# Altium schematic sheet HBridge.SchDoc
size 420 x 297 mm; DocumentNumber: 3; SheetNumber: 3; SheetTotal: 6; PageSetup: Record=PageOptions|CenterHorizontal=True|CenterVertical=True|PrintScale=0.96|XCorrection=1.00|YCorrection=1.00|PrintKind=1|BorderSize=5000000|LeftOffset=0|BottomOffset=0|Orientation=2|PaperLength=4318|PaperWidth=2794|Scale=100|PaperSource=7|PrintQuality=600|MediaType=1|DitherType=10|PaperKind=11" x 17"|PrintScaleMode=1
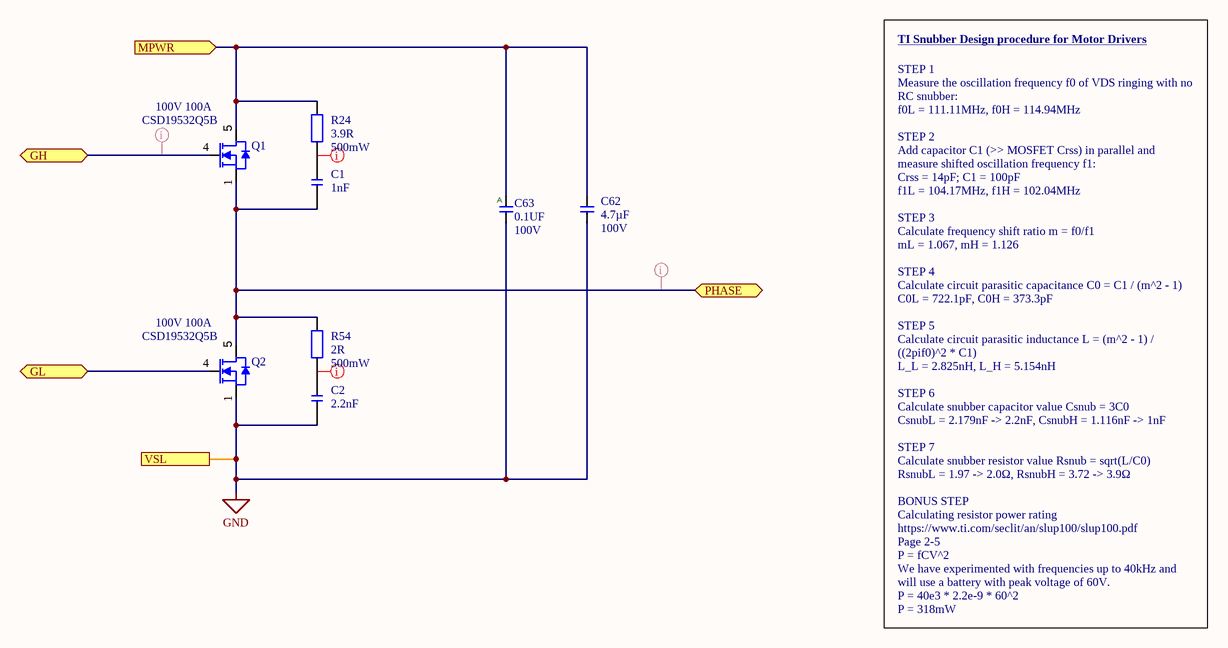
[diagram p0: HBridge.SchDoc]

## Parts
C1  1nF  [CAP 0603_1608 RF]
C2  2.2nF  [CAP 0603_1608 RF]
C62  Voltage - Rated: 100V  Capacitance: 4.7µF  [C1210]  (hidden comment: CAP_CER_1210_4.7UF_100V_20%_X7S)
C63  value 0.1UF  Voltage: 100V  [C0603]  (hidden comment: __Template_Cap_Auto)
NT1  Mechanical Feature NET_TIE_10MIL  [NETTIE_10MIL]  (value not drawn)  (net tie, no BOM)
Q1  value 100V 100A  Manufacturer Part Number: CSD19532Q5B  [TI_SON5X6]  (hidden comment: TI CSD19532Q5B)
Q2  value 100V 100A  Manufacturer Part Number: CSD19532Q5B  [TI_SON5X6]  (hidden comment: TI CSD19532Q5B)
R24  3.9R  Power Rating: 500mW  [RES 0805_2012 RF]
R54  2R  Power Rating: 500mW  [RES 0805_2012 RF]

## Ports
GH (bidir), GL (bidir), MPWR (in), PHASE (bidir), VSL (out)

## Nets
GND: C2.1 C62.2 C63.2 NT1.2 Q2.1(S)
GH: Q1.4(G) ; port GH
GL: Q2.4(G) ; port GL
MPWR: C62.1 C63.1 Q1.5(D) R24.2 ; port MPWR
PHASE: C1.1 Q1.1(S) Q2.5(D) R54.2 ; port PHASE
VSL: NT1.1 ; port VSL
NetC1_2: C1.2 R24.1
NetC2_2: C2.2 R54.1

## Layout directives
net class HVSW: GH, PHASE
net class HV: NetC1_2, NetC2_2

## Notes on the sheet
- TI Snubber Design procedure for Motor Drivers <https://e2e.ti.com/support/motor-drivers-group/motor-drivers/f/motor-drivers-forum/991693/faq-proper-rc-snubber-design-for-motor-drivers>
- STEP 1
  Measure the oscillation frequency f0 of VDS ringing with no RC snubber:
  f0L = 111.11MHz, f0H = 114.94MHz
  STEP 2
  Add capacitor C1 (>> MOSFET Crss) in parallel and measure shifted oscillation frequency f1:
  Crss = 14pF; C1 = 100pF
  f1L = 104.17MHz, f1H = 102.04MHz
  STEP 3
  Calculate frequency shift ratio m = f0/f1
  mL = 1.067, mH = 1.126
  STEP 4
  Calculate circuit parasitic capacitance C0 = C1 / (m^2 - 1)
  C0L = 722.1pF, C0H = 373.3pF
  STEP 5
  Calculate circuit parasitic inductance L = (m^2 - 1) / ((2pif0)^2 * C1)
  L_L = 2.825nH, L_H = 5.154nH
  STEP 6
  Calculate snubber capacitor value Csnub = 3C0
  CsnubL = 2.179nF -> 2.2nF, CsnubH = 1.116nF -> 1nF
  STEP 7
  Calculate snubber resistor value Rsnub = sqrt(L/C0)
  RsnubL = 1.97 -> 2.0Ω, RsnubH = 3.72 -> 3.9Ω
  BONUS STEP
  Calculating resistor power rating
  https://www.ti.com/seclit/an/slup100/slup100.pdf
  Page 2-5
  P = fCV^2
  We have experimented with frequencies up to 40kHz and will use a battery with peak voltage of 60V.
  P = 40e3 * 2.2e-9 * 60^2
  P = 318mW
- CREATIVE COMMONS
- PUBLIC LICENSE:
- BARKOUR ROBOT
- CC BY-NC 4.0
- APPROVED
- DWG NO
- GOOGLE LLC
- FILE
- RELEASED
- 2024/05/09
- SIZE
- 1600 AMPHITHEATRE PARKWAY
- MOUNTAIN VIEW CA 94043
- A3
- SHEET
- OF
- THIS DESIGN IS BEING PROVIDED  FOR NON-COMMERCIAL USE ONLY. THE USE OF =SCIENTIST_NAME_POSSESSIVE NAME IN CONNECTION WITH THE DESIGN IS NOT INTENDED TO IMPLY THAT =SCIENTIST_NAME SPONSORS OR ENDORSES THE DESIGN, GOOGLE LLC, OR ANY OF GOOGLE LLC'S PRODUCTS OR SERVICES.
- (in symbol 1039) A

## Library data of the parts
C1 = C: Automotive grade SMD 0603 capacitor such as Vishay GA....31G series. 1nF 0603 10% X7R 100V; Tolerance: 10%; Temperature Coefficient: X7R; Voltage Rating: 100V; Capacitance: 1nF; Size Code: 0603
C2 = C: Automotive grade SMD 0603 capacitor such as Vishay GA....31G series. 2.2nF 0603 10% X7R 100V; Tolerance: 10%; Temperature Coefficient: X7R; Voltage Rating: 100V; Capacitance: 2.2nF; Size Code: 0603
C62 = CAP_CER_1210_4.7UF_100V_20%_X7S: CAP CER 4.7UF 100V X7S 1210; Manufacturer: TDK Corporation; Manufacturer Part Number: C3225X7S2A475M200AB; Part Number: 150-01016-00; Tolerance: ±20%; Supplier 1: Digi-Key; Supplier Part Number 1: 445-6043-1-ND; RoHS: RoHS Compliant; Category: Capacitors; Stock 1: 146032; Pricing 1: 1=1.4, 10=1.148, 100=0.812, 250=0.672, 500=0.602 (USD); Packaging: Cut Tape (CT); Temperature Coefficient: X7S; Mounting Type: Surface Mount, MLCC; Operating Temperature: -55°C ~ 125°C; Applications: General Purpose; Ratings: -; Package / Case: 1210 (3225 Metric); Size / Dimension: 0.126" L x 0.098" W (3.20mm x 2.50mm); Height - Seated (Max): -; Thickness (Max): 0.087" (2.20mm); Lead Spacing: -; Features: -; Lead Style: -; ComponentLink1URL: http://product.tdk.com/en/catalog/datasheets/mlcc_commercial_midvoltage_en.pdf; ComponentLink1Description: http://product.tdk.com/en/catalog/datasheets/mlcc_commercial_midvoltage_en.pdf
C63 = 1039: CAP, CER, X7S, 0.1uF, 100V, 10%, 0603, AUTOGRADE; ID: 1039; MFG: TDK; MFG P/N: CGA3E3X7S2A104K080AB; Dielectric: X7R; XPN: 150-00222-00; PROXY: 150-03755-00; Gecko: 150-04433-00; EES: 150-04577-00; Status: Released; Package: 0603; Tolerance: 10%; Height: 0.9mm T; ComponentLink1Description: Datasheet; COMMON: 150-00222-00; LOON: 150-00222-00
NT1 = 5ac3c692-7d27-4cd1-ace3-d4aa111a5a9d: Net Tie, 10mil trace; ComponentId: 5ac3c692-7d27-4cd1-ace3-d4aa111a5a9d; Manufacturer: Mechanical; Manufacturer Part Number: NET_TIE_10MIL; Package: Net Tie, 10mil trace; ComponentLink1Description: Datasheet; Category: Mechanical Parts; Status: Preliminary
Q1 Q2 = be020311-d2d7-4d79-a360-c856c6f37d83: MOSFET N-CH 100V 100A 8SON; Part Number: 480-00437-00; Manufacturer: Texas Instruments; Grade: Commercial; Power Rating: 195W; ComponentId: be020311-d2d7-4d79-a360-c856c6f37d83; Package: 8-PowerTDFN SON5x6; ComponentLink1Description: Datasheet; ComponentLink1URL: http://www.ti.com/lit/ds/symlink/csd19532q5b.pdf; Category: N-Channel MOSFETs; Max Height: 1.05mm; Status: Preliminary; Current Rating: 100A; Voltage Rating: 100V; Storage Temperature: -55 °C ~ 150 °C; Operating Temperature: -55 °C ~ 150 °C
R24 = R: High power thick film 0805 resistor such as Vishay CRCW-HP e3 series CRCW08053R90DKEAHP; Tolerance: 1%; Voltage Rating: 150V; Temperature Coefficient: 100ppm/°C; Size Code: 0805; Resistance: 3.9R
R54 = R: High power thick film 0805 resistor such as Vishay CRCW-HP e3 series CRCW08052R00DKEAHP; Tolerance: 1%; Voltage Rating: 150V; Temperature Coefficient: 100ppm/°C; Size Code: 0805; Resistance: 2R